# EAGLE design mains_motion (EAGLE 7.5.0)
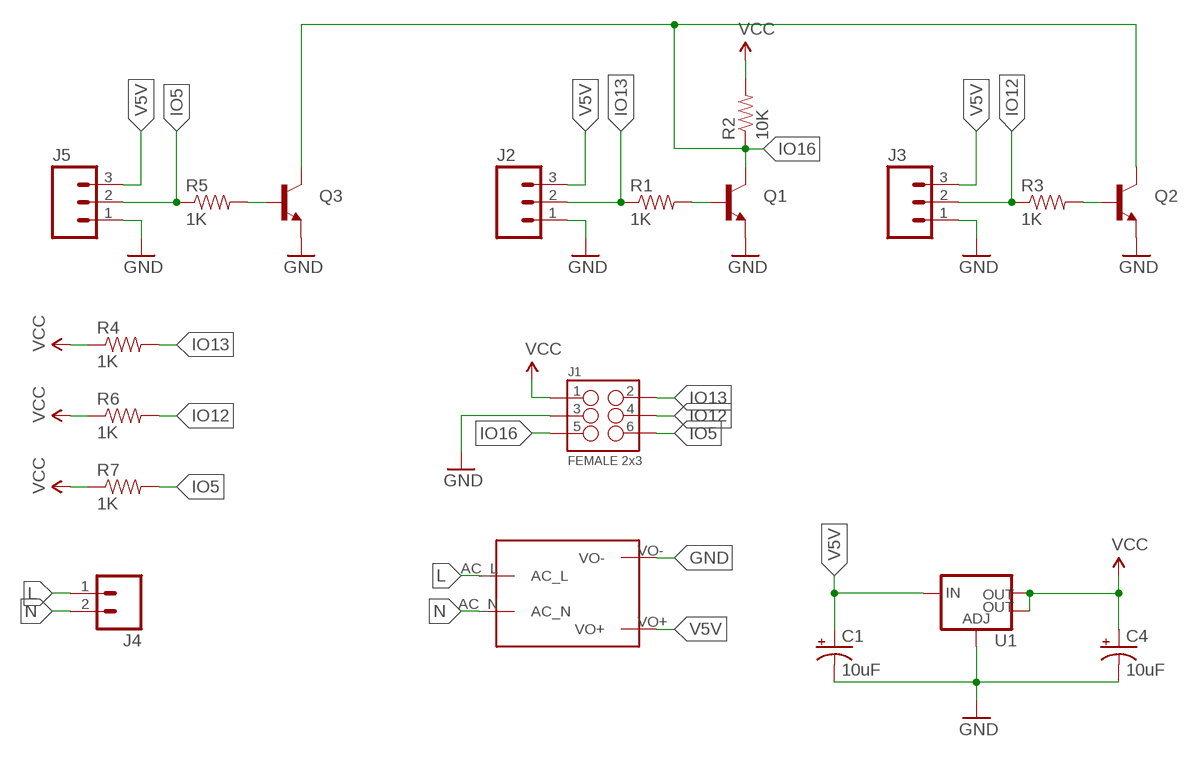
[diagram p0: schematic, sheet 1]

## Parts
C1  10uF  CAP_POL1206-KIT  [EIA3216-KIT]
C4  10uF  CAP_POL1206-KIT  [EIA3216-KIT]
J1  FEMALE 2x3  M03X2SHROUD  [2X3-SHROUDED]
J2  M03PTH  [1X03]
J3  M03PTH  [1X03]
J4  M023.5MM  [SCREWTERMINAL-3.5MM-2]
J5  M03PTH  [1X03]
Q1  TRANSISTOR_NPNSOT23-3  [SOT23-3]
Q2  TRANSISTOR_NPNSOT23-3  [SOT23-3]
Q3  TRANSISTOR_NPNSOT23-3  [SOT23-3]
R1  1K  RESISTOR0805-RES  [0805]
R2  10K  RESISTOR0805-RES  [0805]
R3  1K  RESISTOR0805-RES  [0805]
R4  1K  RESISTOR0805-RES  [0805]
R5  1K  RESISTOR0805-RES  [0805]
R6  1K  RESISTOR0805-RES  [0805]
R7  1K  RESISTOR0805-RES  [0805]
U1  V_REG_LM1117SOT223  [SOT223]
U$1  MAINS_CONVERTERS  [HLK-PM01]

## Nets
GND: C1.C(-) C4.C(-) J1.3 J2.1 J3.1 J5.1 Q1.2(E) Q2.2(E) Q3.2(E) U1.1(ADJ) U$1.VO-
IO5: J1.6 J5.2 R5.1 R7.2
IO12: J1.4 J3.2 R3.1 R6.2
IO13: J1.2 J2.2 R1.1 R4.2
IO16: J1.5 Q1.3(C) Q2.3(C) Q3.3(C) R2.1
L: J4.1 U$1.AC_L
N: J4.2 U$1.AC_N
N$1: Q2.1(B) R3.2
N$2: Q3.1(B) R5.2
N$10: Q1.1(B) R1.2
V5V: C1.A(+) J2.3 J3.3 J5.3 U1.3(IN) U$1.VO+
VCC: C4.A(+) J1.1 R2.2 R4.1 R6.1 R7.1 U1.2(OUT) U1.4(OUT)

## Library data of the parts
C1 C4 = SparkFun-Capacitors:CAP_POL: Capacitor Polarized These are standard SMD and PTH capacitors. Normally 10uF, 47uF, and 100uF in electrolytic and tantalum varieties. Always verify the external diameter of the through hole cap, it varies with capacity, voltage, and manufacturer. The EIA devices should be standard.
J1 = SparkFun-Connectors:M03X2: 2x3 .1" header. Shrouded, with keying- CONN-10681 SMT- CONN-11415 Pogo pins- HW-11044; PROD_ID: CONN-10681
J2 J3 J5 = SparkFun-Connectors:M03: Header 3 Standard 3-pin 0.1" header. Use with straight break away headers (SKU : PRT-00116), right angle break away headers (PRT-00553), swiss pins (PRT-00743), machine pins (PRT-00117), and female headers (PRT-00115). Molex polarized connector foot print use with SKU : PRT-08232 with associated crimp pins and housings.
J4 = SparkFun-Connectors:M02: Standard 2-pin 0.1" header. Use with - straight break away headers ( PRT-00116) - right angle break away headers (PRT-00553) - swiss pins (PRT-00743) - machine pins (PRT-00117) - female headers (PRT-00115) Molex polarized connector foot print use with: PRT-08233 with associated crimp pins and housings. 2.54_SCREWTERM for use with PRT-10571. 3.5mm Screw Terminal footprints for PRT-08084 5mm Screw Terminal footprints for use with PRT-08432; PROD_ID: CONN-08399
Q1-Q3 = SparkFun-DiscreteSemi:TRANSISTOR_NPN: Generic NPN BJT MMBT2222A - TRANS-08049 (SOT-23, 1A 40V) MPSA42 - TRANS-09116 (SOT-23, 500mA 300V) MMBT5088LT1G - TRANS-11160 (SOT-23, 50 mA 30V) BC547 - COM-08928 <http://www.sparkfun.com/products/8928> (TO-92 45V 100mA) (1.Collector 2.Base 3.Emitter) 2N3904 - COM-00521 <http://www.sparkfun.com/products/521> (TO-92 40V 200mA) (1.Emitter 2.Base 3.Collector) P2N2222A - COM-12852 <http://www.sparkfun.com/products/12852> (TO-92 40V 600mA) (1.Collector 2.Base 3.Emitter); PROD_ID: TRANS-08049
R1-R7 = SparkFun-Passives:RESISTOR: Resistor Basic schematic elements and footprints for 0603, 1206, and PTH resistors.
U1 = SparkFun-PowerIC:V_REG_LM1117: Voltage Regulator LM1117 Standard adjustable voltage regulator but in SMD form. Spark Fun Electronics SKU : COM-00595; PROD_ID: VREG-08170
U$1 = captain-slow:MAINS_CONVERTERS

## Board
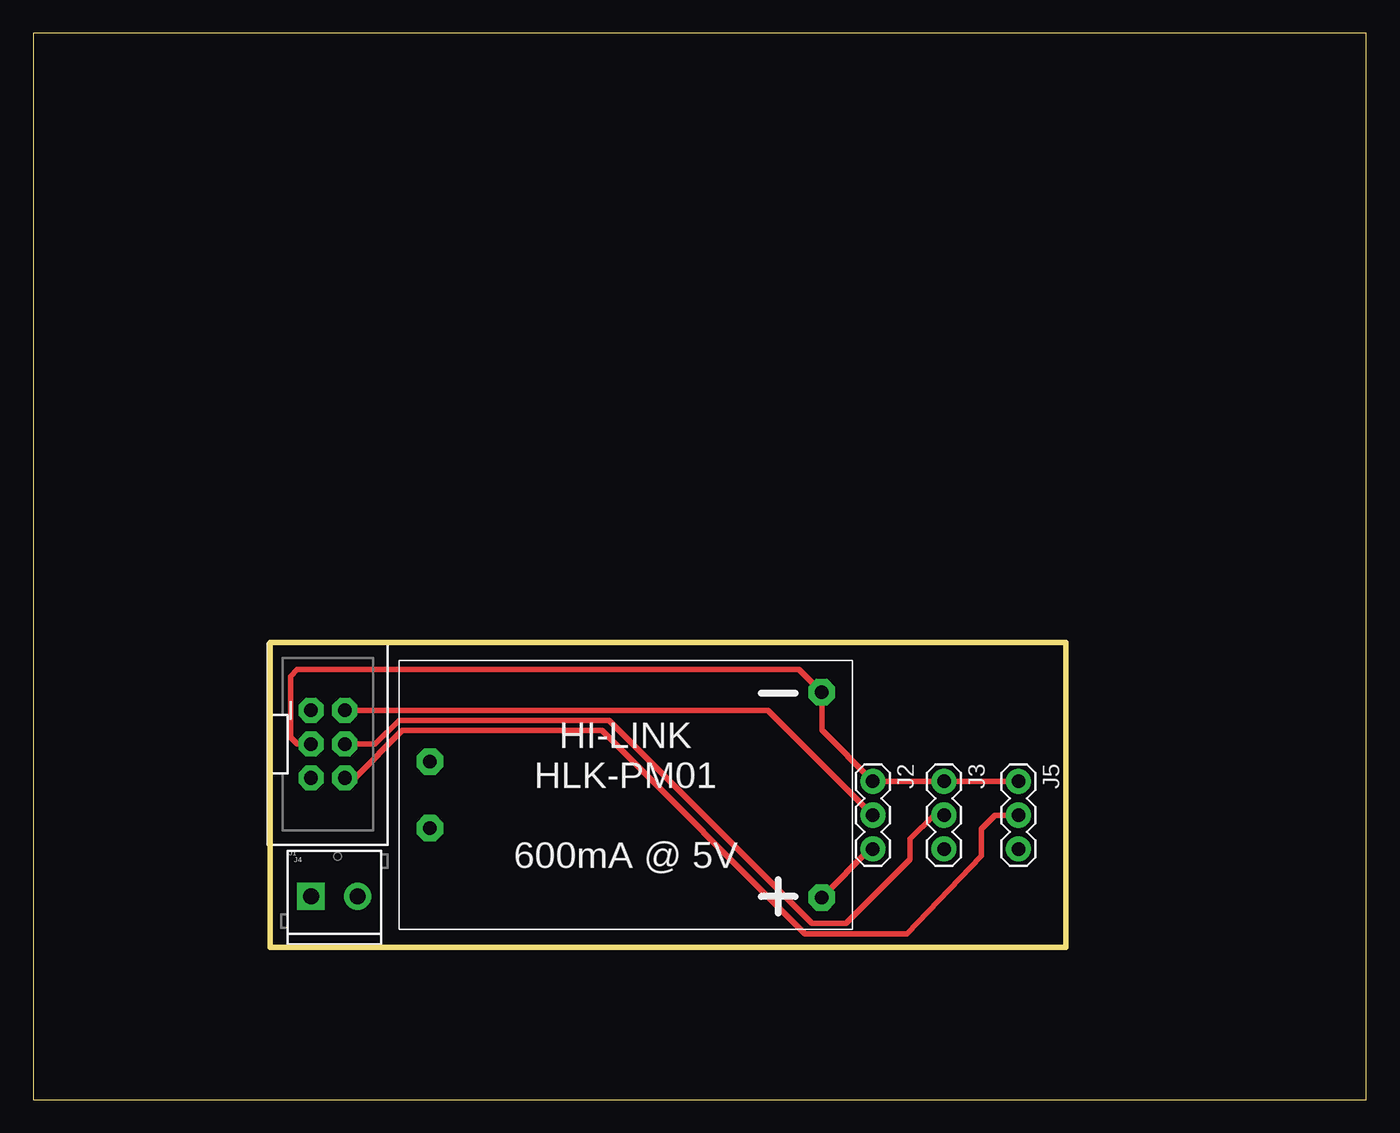
[diagram p1: board, top side]
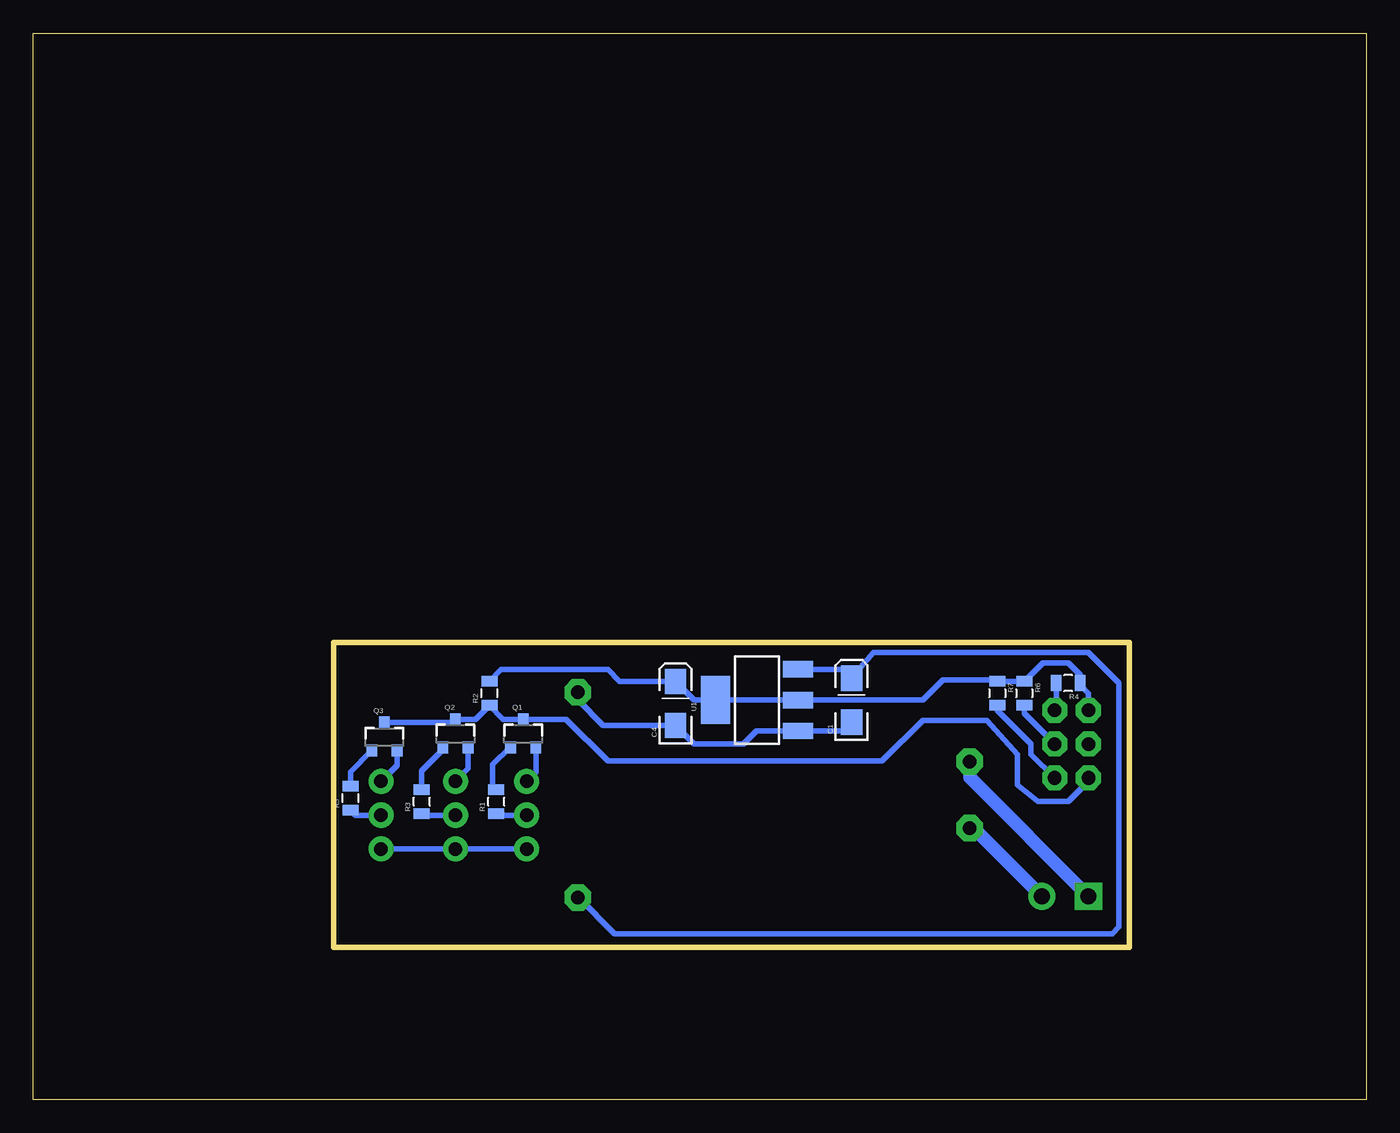
[diagram p2: board, bottom side, seen from below]

Size 100 x 80 mm. Coordinates in mm from the lower left corner, seen from the top.
Outline: 0,0 100,0 100,80 0,80 0,0
Outline: 17.78,34.29 77.47,34.29 77.47,11.43 17.78,11.43 17.78,34.29
Copper layers (1*16): Top 0.035mm / dielectric 1.5mm / Bottom 0.035mm
Design rules "default": minimum track width 10mil, minimum drill 24mil, track to track 8mil, track to pad 8mil, pad to pad 8mil, via to via 8mil, smd to smd 8mil, copper to edge 40mil, drill to drill 8mil, minimum pad ring 10mil, minimum via ring 8mil, stop-mask expansion 4mil, vias tented up to drill 0mil, thermal gap 10mil

### Footprints (pad centres in the part's own frame; a part is rotated, then mirrored left to right if it is on the bottom)
EIA3216-KIT = smd 1.9 x 1.6: A 1.65,0; C -1.65,0
2X3-SHROUDED = drill 1.016 pad 1.88 octagon: 1 -1.27,2.54; 2 1.27,2.54; 3 -1.27,0; 4 1.27,0; 5 -1.27,-2.54; 6 1.27,-2.54
1X03 = drill 1.016 pad 1.88: 1 0,0; 2 2.54,0; 3 5.08,0
SCREWTERMINAL-3.5MM-2 = drill 1.2 pad 2.032 square: 1 0,0 | drill 1.2 pad 2.032: 2 3.5,0
SOT23-3 = smd 0.8 x 0.9: 1 -0.95,-1; 2 0.95,-1; 3 0,1.1
0805 = smd 0.8 x 1.2: 1 -0.9,0; 2 0.9,0
SOT223 = smd 1.219 x 2.235: 1 -2.311,-3.099; 2 0,-3.099; 3 2.311,-3.099 | smd 3.6 x 2.2: 4 0,3.099
HLK-PM01 = drill 1 pad 2 octagon: AC_L -14.7,2.5; AC_N -14.7,-2.5; VO+ 14.7,-7.7; VO- 14.7,7.7

### Placement (x,y rotation side)
C1  38.61,29.97 90 bottom
C4  51.82,29.72 90 bottom
J1  22.1,26.67 0 top
J2  62.99,23.88 270 top
J3  68.33,23.88 270 top
J4  20.83,15.24 0 top
J5  73.91,23.88 270 top
Q1  63.25,27.43 0 bottom
Q2  68.33,27.43 0 bottom
Q3  73.66,27.18 0 bottom
R1  65.28,22.35 90 bottom
R2  65.79,30.48 90 bottom
R3  70.87,22.35 90 bottom
R4  22.35,31.24 180 bottom
R5  76.2,22.61 90 bottom
R6  25.65,30.48 270 bottom
R7  27.69,30.48 270 bottom
U1  45.72,29.97 90 bottom
U$1  44.45,22.86 0 top

### Tracks (layer width: path | path; a pad name or v marks a point on that pad's centre or on a via)
GND
  Top 0.406: J5.1 J3.1 J2.1 59.15,27.72 U$1.VO- 57.45,32.26 19.81,32.26 19.3,31.75 19.3,27.18 19.81,26.67 J1.3
  Bottom 0.406: Q1.2 62.3,24.57 J2.1 | Q3.2 72.71,25.08 J5.1 | C1.C 39.27,27.66 U1.1 45.74,27.66 46.74,26.67 50.42,26.67 C4.C 57.25,28.07 59.15,29.97 U$1.VO- | Q2.2 67.38,24.83 J3.1
IO5
  Top 0.406: J5.2 72.14,21.34 71.12,20.32 71.12,18.29 65.53,12.45 57.91,12.45 42.67,27.69 27.69,27.69 24.13,24.13 J1.6
  Bottom 0.406: R7.2 27.69,29.21 25.15,26.67 25.15,25.91 J1.6 | 76.2,21.59 R5.1 75.83,21.34 J5.2
IO12
  Top 0.406: J1.4 25.65,26.67 27.43,28.45 43.18,28.45 58.42,13.21 60.96,13.21 65.79,18.03 65.79,19.56 67.56,21.34 J3.2
  Bottom 0.406: J3.2 70.75,21.34 R3.1 | R6.2 25.65,28.96 J1.4
IO13
  Top 0.406: J1.2 55.12,29.21 J2.2
  Bottom 0.406: J2.2 65.16,21.34 R1.1 | R4.2 23.25,29.33 J1.2
IO16
  Bottom 0.406: Q3.3 68.58,28.28 Q2.3 66.83,28.53 R2.1 64.74,28.53 Q1.3 60.03,28.53 56.9,25.4 36.32,25.4 33.27,28.45 28.45,28.45 26.16,25.91 26.16,23.62 24.64,22.35 22.35,22.35 20.83,23.88 J1.5
L
  Bottom 1.016: U$1.AC_L 29.75,24.16 J4.1
N
  Bottom 1.016: U$1.AC_N 29.45,20.36 J4.2
N$1
  Bottom 0.406: Q2.1 69.28,26.23 70.87,24.64 R3.2
N$2
  Bottom 0.406: R5.2 76.2,24.59 Q3.1
N$10
  Bottom 0.406: Q1.1 64.25,26.43 65.53,25.15 65.53,23.51 R1.2
V5V
  Top 0.406: J2.3 62.79,18.8 U$1.VO+
  Bottom 0.406: U1.3 39.27,32.28 C1.A 36.96,33.53 20.83,33.53 18.54,31.24 18.54,12.95 19.05,12.45 56.39,12.45 59.1,15.16 U$1.VO+ | J2.3 J3.3 J5.3
VCC
  Bottom 0.406: R2.2 64.91,32.26 56.9,32.26 56.01,31.37 C4.A 50.42,29.97 U1.4 U1.2 33.27,29.97 31.75,31.5 27.8,31.5 R7.1 R6.1 24.27,32.77 22.35,32.77 21.45,31.87 R4.1 21.45,31.1 20.83,30.48 J1.1